# EAGLE design picB4currentreading (EAGLE 9.0.1)
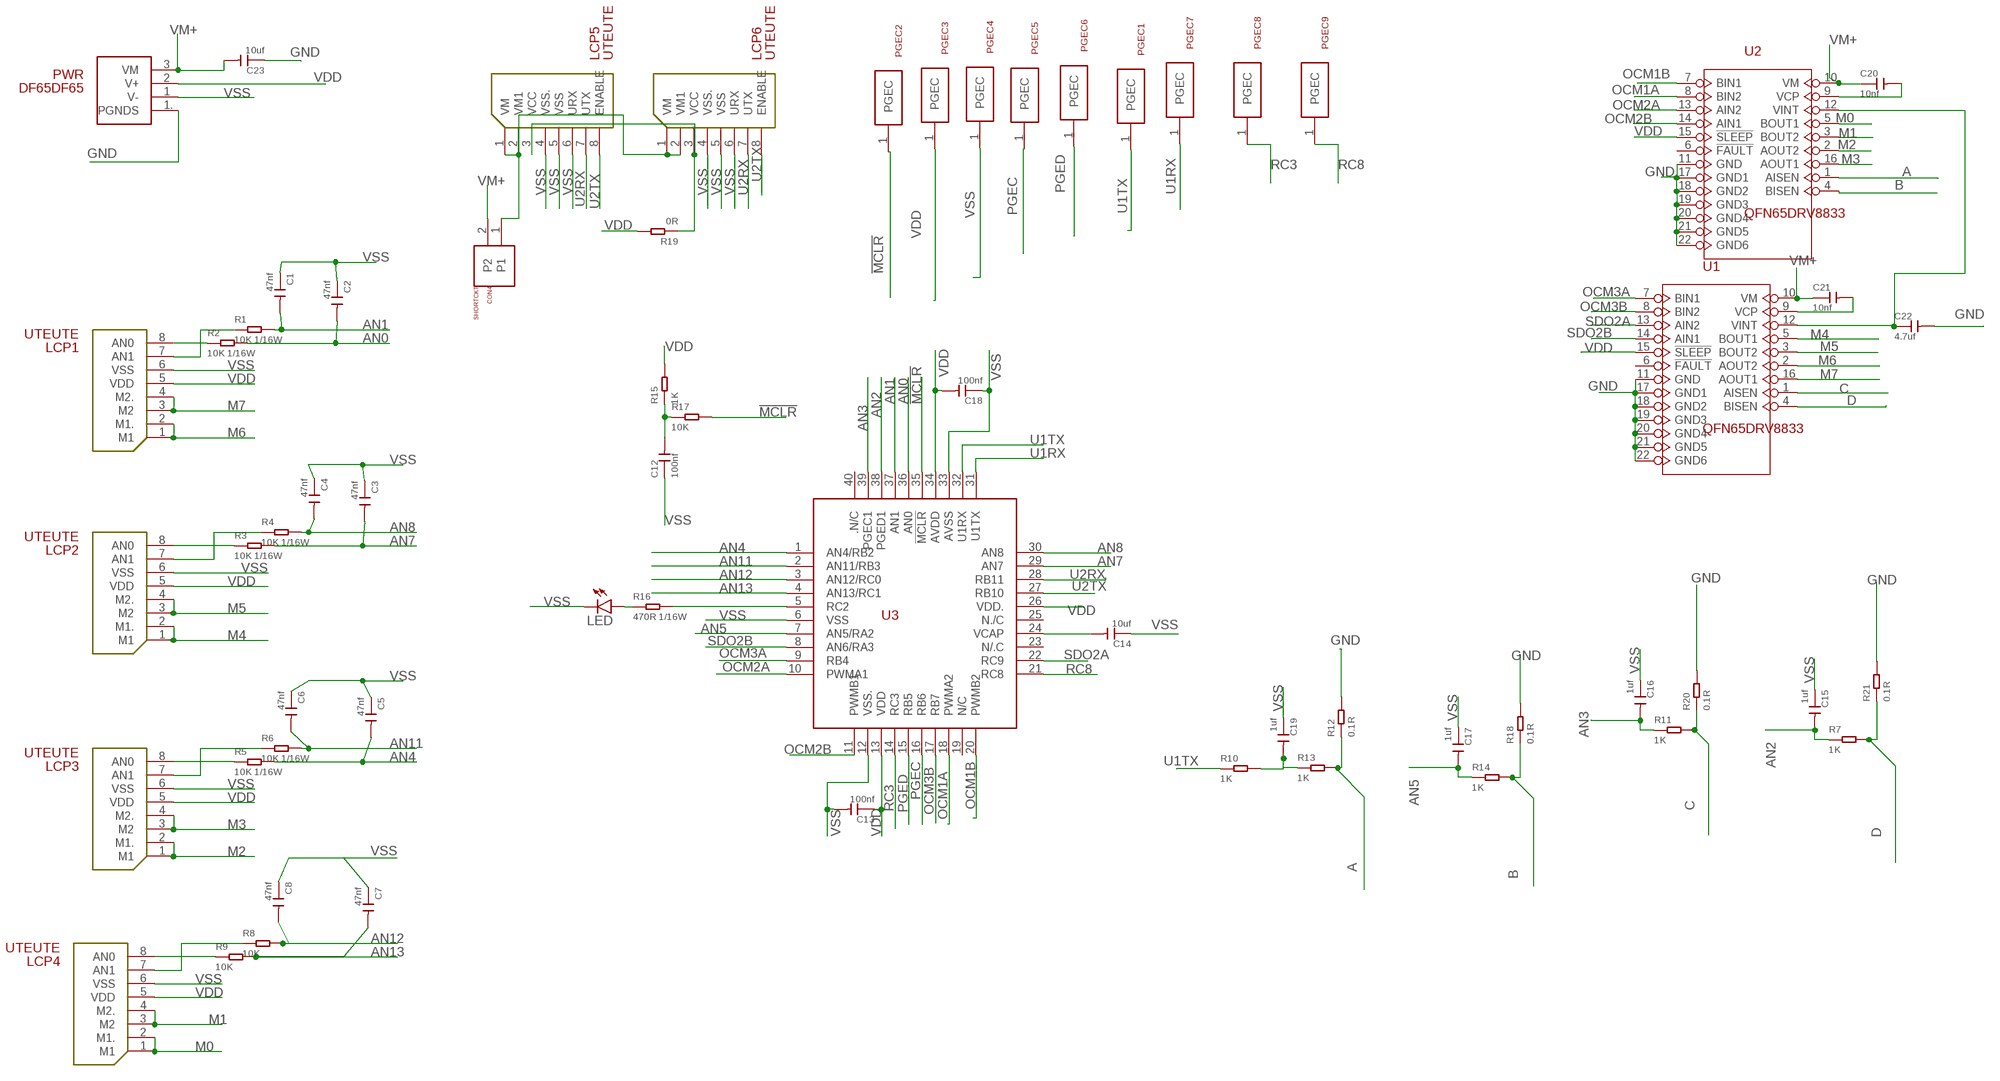
[diagram p0: schematic, sheet 1]

## Parts
C1  47nf  CERAMIC-47NF-25V-10%-X7R(0402)  [C0402]
C2  47nf  CERAMIC-47NF-25V-10%-X7R(0402)  [C0402]
C3  47nf  CERAMIC-47NF-25V-10%-X7R(0402)  [C0402]
C4  47nf  CERAMIC-47NF-25V-10%-X7R(0402)  [C0402]
C5  47nf  CERAMIC-47NF-25V-10%-X7R(0402)  [C0402]
C6  47nf  CERAMIC-47NF-25V-10%-X7R(0402)  [C0402]
C7  47nf  CERAMIC-47NF-25V-10%-X7R(0402)  [C0402]
C8  47nf  CERAMIC-47NF-25V-10%-X7R(0402)  [C0402]
C12  100nf  CERAMIC-100NF-25V-10%-X7R(0402)  [C0402]
C13  100nf  CERAMIC-100NF-25V-10%-X7R(0402)  [C0402]
C14  10uf  CERAMIC-10UF-6.3V-20%-X5R(0402)  [C0402]
C15  1uf  CERAMIC-1UF-10V-10%-X5R(0402)  [C0402]
C16  1uf  CERAMIC-1UF-10V-10%-X5R(0402)  [C0402]
C17  1uf  CERAMIC-1UF-10V-10%-X5R(0402)  [C0402]
C18  100nf  CERAMIC-100NF-25V-10%-X7R(0402)  [C0402]
C19  1uf  CERAMIC-1UF-10V-10%-X5R(0402)  [C0402]
C20  10nf  CERAMIC-10NF-50V-10%-X7R(0402)  [C0402]
C21  10nf  CERAMIC-10NF-50V-10%-X7R(0402)  [C0402]
C22  4.7uf  CERAMIC-4.7UF-6.3V-20%-X5R(0402)  [C0402]
C23  10uf  CERAMIC-10UF-6.3V-20%-X5R(0402)  [C0402]
CON4  SHORTCKT  [SHORT]
LCP1  UTEUTE  [UTE]
LCP2  UTEUTE  [UTE]
LCP3  UTEUTE  [UTE]
LCP4  UTEUTE  [UTE]
LCP5  UTEUTE  [UTE]
LCP6  UTEUTE  [UTE]
LED  LEDCHIP-LED0603  [CHIP-LED0603]
PGEC1  PGECPGEC  [PGEC]
PGEC2  PGECPGEC  [PGEC]
PGEC3  PGECPGEC  [PGEC]
PGEC4  PGECPGEC  [PGEC]
PGEC5  PGECPGEC  [PGEC]
PGEC6  PGECPGEC  [PGEC]
PGEC7  PGECPGEC  [PGEC]
PGEC8  PGECPGEC  [PGEC]
PGEC9  PGECPGEC  [PGEC]
PWR  DF65DF65  [DF65]
R1  10K 1/16W  SMD-RES-10K-1%-1/16W(0402)  [R0402]
R2  10K 1/16W  SMD-RES-10K-1%-1/16W(0402)  [R0402]
R3  10K 1/16W  SMD-RES-10K-1%-1/16W(0402)  [R0402]
R4  10K 1/16W  SMD-RES-10K-1%-1/16W(0402)  [R0402]
R5  10K 1/16W  SMD-RES-10K-1%-1/16W(0402)  [R0402]
R6  10K 1/16W  SMD-RES-10K-1%-1/16W(0402)  [R0402]
R7  1K  SMD-RES-1K-5%-1/16W(0402)  [R0402]
R8  10K  SMD-RES-10K-5%-1/(0402)  [R0402]
R9  10K  SMD-RES-10K-5%-1/(0402)  [R0402]
R10  1K  SMD-RES-1K-5%-1/16W(0402)  [R0402]
R11  1K  SMD-RES-1K-5%-1/16W(0402)  [R0402]
R12  0.1R  SMD-RES-0.1R-5%-1/8W(0805)  [R0805]
R13  1K  SMD-RES-1K-5%-1/16W(0402)  [R0402]
R14  1K  SMD-RES-1K-5%-1/16W(0402)  [R0402]
R15  1K  SMD-RES-1K-5%-1/16W(0402)  [R0402]
R16  470R 1/16W  SMD-RES-470R-5%-1/16W(0402)  [R0402]
R17  10K  SMD-RES-10K-5%-1/(0402)  [R0402]
R18  0.1R  SMD-RES-0.1R-5%-1/8W(0805)  [R0805]
R19  0R  SMD-RES-0R-5%-1/16W(0402)  [R0402]
R20  0.1R  SMD-RES-0.1R-5%-1/8W(0805)  [R0805]
R21  0.1R  SMD-RES-0.1R-5%-1/8W(0805)  [R0805]
U1  QFN65DRV8833  [QFN65P400X400X80-17N]
U2  QFN65DRV8833  [QFN65P400X400X80-17N]
U3  PIC32MM0064GPL036PIC32MM0064GPL36  [UQFN40MV5X5MM]

## Nets
!MCLR!: PGEC2.1(PGEC) R17.2 U3.35(!MCLR!)
A: R12.1 R13.2 U2.1(AISEN)
AN0: C2.2 R2.2 U3.36(AN0)
AN1: C1.2 R1.2 U3.37(AN1)
AN2: C15.2 R7.1 U3.38(PGED1)
AN3: C16.2 R11.1 U3.39(PGEC1)
AN4: C5.2 R5.2 U3.1(AN4/RB2)
AN5: C17.2 R14.1 U3.7(AN5/RA2)
AN7: C3.2 R3.2 U3.29(AN7)
AN8: C4.2 R4.2 U3.30(AN8)
AN11: C6.2 R6.2 U3.2(AN11/RB3)
AN12: C8.2 R8.2 U3.3(AN12/RC0)
AN13: C7.2 R9.2 U3.4(AN13/RC1)
B: R14.2 R18.1 U2.4(BISEN)
C: R11.2 R20.1 U1.1(AISEN)
D: R7.2 R21.1 U1.4(BISEN)
GND: C22.2 C23.1 PWR.1.(PGNDS) R12.2 R18.2 R20.2 R21.2 U1.11(GND) U1.17(GND1) U1.18(GND2) U1.19(GND3) U1.20(GND4) U1.21(GND5) U1.22(GND6) U2.11(GND) U2.17(GND1) U2.18(GND2) U2.19(GND3) U2.20(GND4) U2.21(GND5) U2.22(GND6)
M0 [motor line]: LCP4.1(M1) LCP4.2(M1.) U2.5(BOUT1)
M1 [motor line]: LCP4.3(M2) LCP4.4(M2.) U2.3(BOUT2)
M2 [motor line]: LCP3.1(M1) LCP3.2(M1.) U2.2(AOUT2)
M3 [motor line]: LCP3.3(M2) LCP3.4(M2.) U2.16(AOUT1)
M4 [motor line]: LCP2.1(M1) LCP2.2(M1.) U1.5(BOUT1)
M5 [motor line]: LCP2.3(M2) LCP2.4(M2.) U1.3(BOUT2)
M6 [motor line]: LCP1.1(M1) LCP1.2(M1.) U1.2(AOUT2)
M7 [motor line]: LCP1.3(M2) LCP1.4(M2.) U1.16(AOUT1)
N$2: LCP1.8(AN0) R2.1
N$3: C19.2 R10.2 R13.1
N$4: LCP3.7(AN1) R6.1
N$5: CON4.1 LCP5.1(VM) LCP5.2(VM1) LCP6.1(VM) LCP6.2(VM1)
N$6: LCP2.8(AN0) R3.1
N$7: LCP4.7(AN1) R8.1
N$8: LCP3.8(AN0) R5.1
N$9: LCP2.7(AN1) R4.1
N$10: LCP1.7(AN1) R1.1
N$11: C12.2 R15.1 R17.1
N$12: R16.2 U3.5(RC2)
N$13: LED.A R16.1
N$14: LCP5.3(VCC) LCP6.3(VCC) R19.1
N$17: LCP4.8(AN0) R9.1
N$20: C20.2 U2.9(VCP)
N$22: C21.2 U1.9(VCP)
N$23: C22.1 U1.12(VINT) U2.12(VINT)
N$41: C14.2 U3.24(VCAP)
OCM1A: U2.8(BIN2) U3.18(PWMA2)
OCM1B: U2.7(BIN1) U3.20(PWMB2)
OCM2A: U2.13(AIN2) U3.10(PWMA1)
OCM2B: U2.14(AIN1) U3.11(PWMB1)
OCM3A: U1.7(BIN1) U3.9(RB4)
OCM3B: U1.8(BIN2) U3.17(RB7)
PGEC: PGEC5.1(PGEC) U3.16(RB6)
PGED: PGEC6.1(PGEC) U3.15(RB5)
RC3: PGEC8.1(PGEC) U3.14(RC3)
RC8: PGEC9.1(PGEC) U3.21(RC8)
SDO2A: U1.13(AIN2) U3.22(RC9)
SDO2B: U1.14(AIN1) U3.8(AN6/RA3)
U1RX: PGEC7.1(PGEC) U3.31(U1TX)
U1TX: PGEC1.1(PGEC) R10.1 U3.32(U1RX)
U2RX: LCP5.7(UTX) LCP6.7(UTX) U3.28(RB11)
U2TX: LCP5.8(ENABLE) LCP6.8(ENABLE) U3.27(RB10)
VDD [power]: C13.1 C18.2 LCP1.5(VDD) LCP2.5(VDD) LCP3.5(VDD) LCP4.5(VDD) PGEC3.1(PGEC) PWR.2(V+) R15.2 R19.2 U1.15(!SLEEP!) U2.15(!SLEEP!) U3.13(VDD) U3.26(VDD.) U3.34(AVDD)
VM+ [motor line]: C20.1 C21.1 C23.2 CON4.2 PWR.3(VM) U1.10(VM) U2.10(VM)
VSS [power]: C1.1 C2.1 C3.1 C4.1 C5.1 C6.1 C7.1 C8.1 C12.1 C13.2 C14.1 C15.1 C16.1 C17.1 C18.1 C19.1 LCP1.6(VSS) LCP2.6(VSS) LCP3.6(VSS) LCP4.6(VSS) LCP5.4(VSS.) LCP5.5(VSS) LCP5.6(URX) LCP6.4(VSS.) LCP6.5(VSS) LCP6.6(URX) LED.C PGEC4.1(PGEC) PWR.1(V-) U3.6(VSS) U3.12(VSS.) U3.33(AVSS)
Unconnected: U1.6(!FAULT!) U2.6(!FAULT!) U3.19(N/C) U3.23(N/.C) U3.25(N./C) U3.40(.N/C)

## Library data of the parts
C1-C8 = Seeed-Capacitor:CERAMIC-47NF-25V-10%-X7R(0402): 302010002; MPN: CC0402KRX7R8BB473
C12 C13 C18 = Seeed-Capacitor:CERAMIC-100NF-25V-10%-X7R(0402): 302010024; MPN: CC0402KRX7R8BB104
C14 C23 = Seeed-Capacitor:CERAMIC-10UF-6.3V-20%-X5R(0402): 302010053; MPN: CC0402MRX5R5BB106
C15-C17 C19 = Seeed-Capacitor:CERAMIC-1UF-10V-10%-X5R(0402): 302010040; MPN: CC0402KRX5R6BB105
C20 C21 = Seeed-Capacitor:CERAMIC-10NF-50V-10%-X7R(0402): 302010006; MPN: CC0402KRX7R9BB103
C22 = Seeed-Capacitor:CERAMIC-4.7UF-6.3V-20%-X5R(0402): 302010019; MPN: CC0402MRX5R5BB475
CON4 = short:SHORT: <this is a point connectors and used for the short circuit the connections point if we needed >
LCP1-LCP4 = ute5526:UTE
LCP5 LCP6 = ute5526(uart):UTE
LED = led:LED: LED OSRAM: - CHIPLED LG R971, LG N971, LY N971, LG Q971, LY Q971, LO R971, LY R971 LH N974, LH R974 LS Q976, LO Q976, LY Q976 LO Q996 - Hyper CHIPLED LW Q18S LB Q993, LB Q99A, LB R99A - SideLED LS A670, LO A670, LY A670, LG A670, LP A670 LB A673, LV A673, LT A673, LW A673 LH A674 LY A675 LS A676, LA A676, LO A676, LY A676, LW A676 LS A679, LY A679, LG A679 - Hyper Micro SIDELED® LS Y876, LA Y876, LO Y876, LY Y876 LT Y87S - SmartLED LW L88C, LW L88S LB L89C, LB L89S, LG L890 LS L89K, LO L89K, LY L89K LS L896, LA L896, LO L896, LY L896 - TOPLED LS T670, LO T670, LY T670, LG T670, LP T670 LSG T670, LSP T670, LSY T670, LOP T670, LYG T670 LG T671, LOG T671, LSG T671 LB T673, LV T673, LT T673, LW T673 LH T674 LS T676, LA T676, LO T676, LY T676, LB T676, LH T676, LSB T676, LW T676 LB T67C, LV T67C, LT T67C, LS T67K, LO T67K, LY T67K, LW E67C LS E67B, LA E67B, LO E67B, LY E67B, LB E67C, LV E67C, LT E67C LW T67C LS T679, LY T679, LG T679 LS T770, LO T770, LY T770, LG T770, LP T770 LB T773, LV T773, LT T773, LW T773 LH T774 LS E675, LA E675, LY E675, LS T675 LS T776, LA T776, LO T776, LY T776, LB T776 LHGB T686 LT T68C, LB T68C - Hyper Mini TOPLED® LB M676 - Mini TOPLED Santana® LG M470 LS M47K, LO M47K, LY M47K Source: http://www.osram.convergy.de LUXEON: - LUMILED® LXK2-PW12-R00, LXK2-PW12-S00, LXK2-PW14-U00, LXK2-PW14-V00 LXK2-PM12-R00, LXK2-PM12-S00, LXK2-PM14-U00 LXK2-PE12-Q00, LXK2-PE12-R00, LXK2-PE12-S00, LXK2-PE14-T00, LXK2-PE14-U00 LXK2-PB12-K00, LXK2-PB12-L00, LXK2-PB12-M00, LXK2-PB14-N00, LXK2-PB14-P00, LXK2-PB14-Q00 LXK2-PR12-L00, LXK2-PR12-M00, LXK2-PR14-Q00, LXK2-PR14-R00 LXK2-PD12-Q00, LXK2-PD12-R00, LXK2-PD12-S00 LXK2-PH12-R00, LXK2-PH12-S00 LXK2-PL12-P00, LXK2-PL12-Q00, LXK2-PL12-R00 Source: www.luxeon.com KINGBRIGHT: KA-3528ASYC Source: www.kingbright.com
PGEC1-PGEC9 = pgec:PGEC: <this is a programming pin for the catchy point means PGEC port>
PWR = df65:DF65: <1.7mm pitch, Low Profile Wire-to-Board Connectors for Power Supplies DF65 series >
R1-R6 = Seeed-Resistor:SMD-RES-10K-1%-1/16W(0402): 301010047; MPN: RC0402FR-0710KL
R7 R10 R11 R13-R15 = Seeed-Resistor:SMD-RES-1K-5%-1/16W(0402): 301010006; MPN: RC0402JR-071KL
R8 R9 R17 = Seeed-Resistor:SMD-RES-10K-5%-1/(0402): 301010004; MPN: RC0402JR-0710KL
R12 R18 R20 R21 = Seeed-Resistor:SMD-RES-0.1R-5%-1/8W(0805): 301010264; MPN: RL0805JR-070R1L
R16 = Seeed-Resistor:SMD-RES-470R-5%-1/16W(0402): 301010013; MPN: RC0402JR-07470RL
R19 = Seeed-Resistor:SMD-RES-0R-5%-1/16W(0402): 301010000; MPN: RC0402JR-070RL
U1 U2 = QFN65P400X400X80-17N:QFN65
U3 = pic32xx40:PIC32MM0064GPL036

## Net classes
0 default: width 0.008 mm, clearance 0.152 mm
1 power: width 0 mm, drill 0 mm, clearance 0.152 mm
2 motor line: width 0 mm, clearance 0.152 mm

## Board
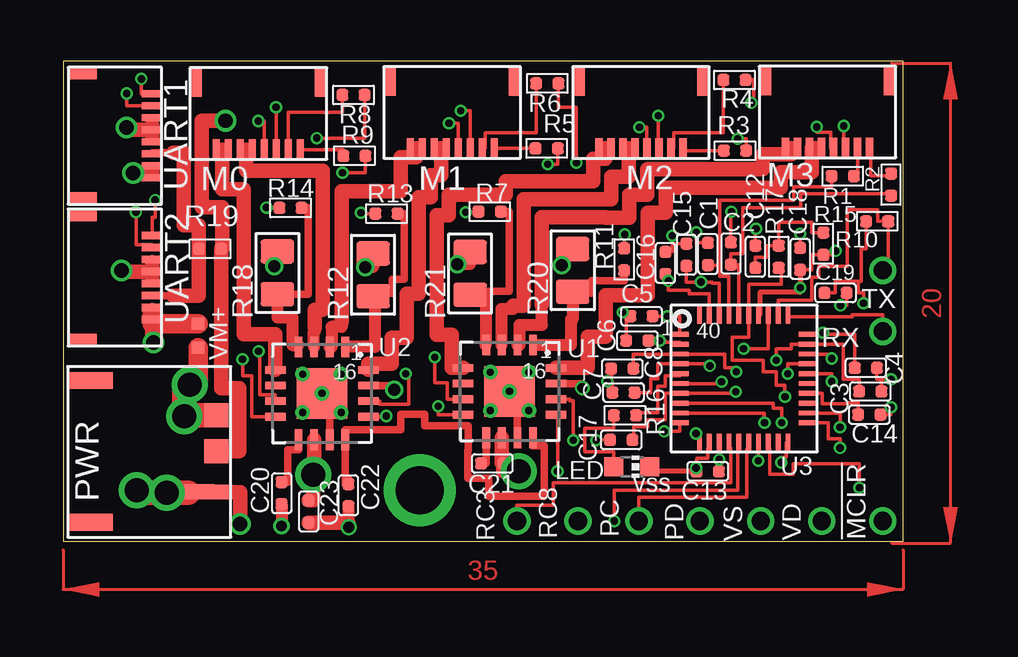
[diagram p1: board, top side]
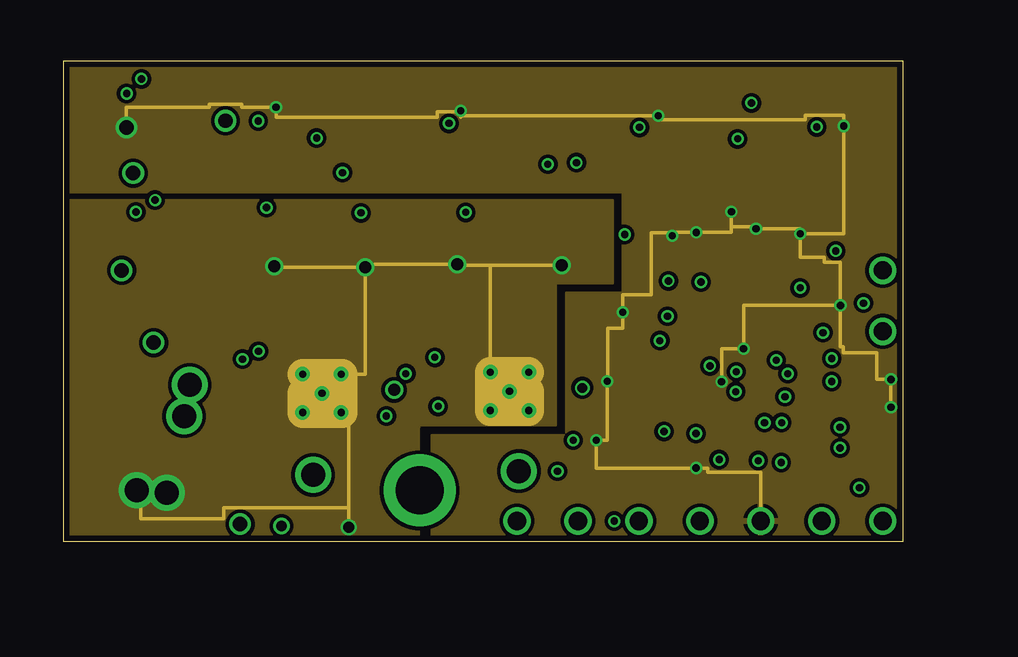
[diagram p2: board, inner layer Route2]
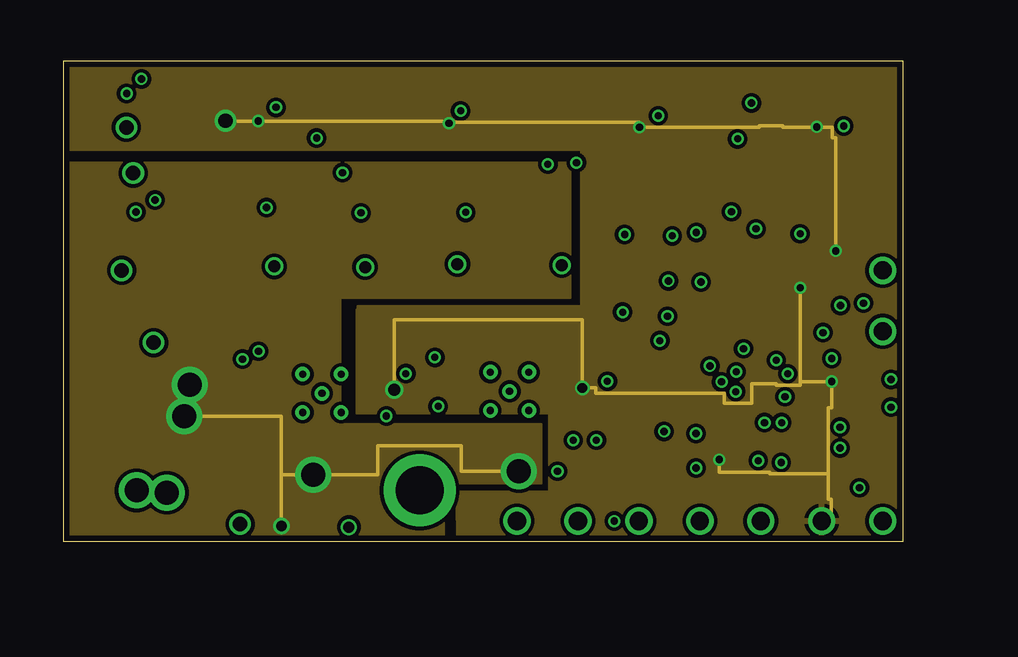
[diagram p3: board, inner layer Route15]
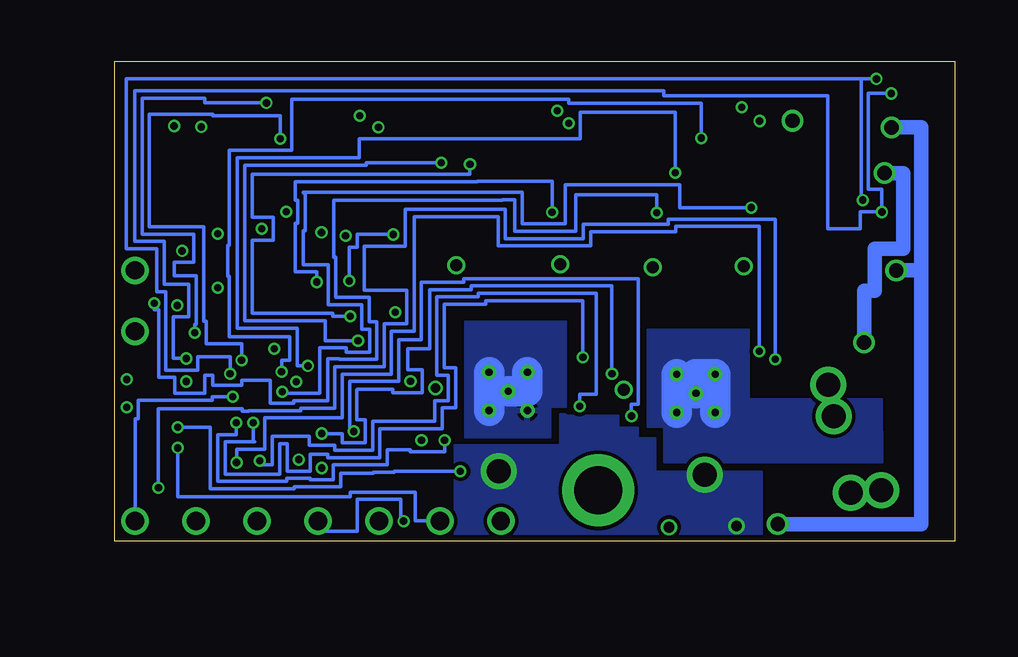
[diagram p4: board, bottom side, seen from below]

Size 35 x 20 mm. Coordinates in mm from the lower left corner, seen from the top.
Outline: 0,0 35,0 35,20 0,20 0,0
Copper layers (1*2*15*16): Top 0.035mm / dielectric 0.2mm / Route2 0.0175mm / dielectric 0.3mm / Route15 0.0175mm / dielectric 0.2mm / Bottom 0.035mm
Design rules "SeeedStudio_4layer_DRU_no_angle_20140221 *": minimum track width 6mil, minimum drill 6mil, track to track 4mil, track to pad 6mil, pad to pad 8mil, via to via 8mil, smd to smd 0mil, copper to edge 10mil, drill to drill 6mil, minimum pad ring 6mil, minimum via ring 4mil, stop-mask expansion 4mil, vias tented up to drill 250mil, thermal gap 6mil

### Footprints (pad centres in the part's own frame; a part is rotated, then mirrored left to right if it is on the bottom)
C0402 = smd 0.5 x 0.5: 1 0,0.463; 2 0,-0.463
SHORT = smd 0.5 x 0.5: 1 0.27,0.46; 2 0.27,-0.54
UTE = smd 0.85 x 0.3: 1 -3.5,1; 2 -3.5,0.5; 3 -3.5,0; 4 -3.5,-0.5; 5 -3.5,-1; 6 -3.5,-1.5; 7 -3.5,-2; 8 -3.5,-2.5 | smd 1.15 x 0.5: 9 -0.725,1.85; 10 -0.725,-3.35
UTE' = smd 0.85 x 0.3: 1 -3.5,1; 2 -3.5,0.5; 3 -3.5,0; 4 -3.5,-0.5; 5 -3.5,-1; 6 -3.5,-1.5; 7 -3.5,-2; 8 -3.5,-2.5 | smd 1.15 x 0.5: 9 -0.625,1.85; 10 -0.625,-3.35
CHIP-LED0603 = smd 0.8 x 0.8: A 0,-0.75; C 0,0.75
PGEC = drill 0.76: 1 0,0
DF65 = smd 1 x 0.6: 1 -2.58,1.73 | smd 1.27 x 0.635: 1. -1.882,1.72 | smd 1 x 1: 2 -2.58,0.03; 3 -2.58,-1.47 | smd 1.8 x 0.7: P$4 2.62,2.98; P$5 2.62,-2.92
R0402 = smd 0.5 x 0.5: 1 0,0.463; 2 0,-0.463
R0805 = smd 1.397 x 1.016: 1 0,0.889; 2 0,-0.889
QFN65P400X400X80-17N = smd 0.86 x 0.32: 1 -1.935,0.975; 2 -1.935,0.325; 3 -1.935,-0.325; 4 -1.935,-0.975; 9 1.935,-0.975; 10 1.935,-0.325; 11 1.935,0.325; 12 1.935,0.975 | smd 0.32 x 0.86: 5 -0.975,-1.935; 6 -0.325,-1.935; 7 0.325,-1.935; 8 0.975,-1.935; 13 0.975,1.935; 14 0.325,1.935; 15 -0.325,1.935; 16 -0.975,1.935 | smd 2.1 x 2.1: 17 0,0 | drill 0.3: 18 -0.8,0.8; 19 0.8,0.8; 20 -0.8,-0.8; 21 0.8,-0.8; 22 0,0
UQFN40MV5X5MM = smd 0.75 x 0.2: 1 -2.63,1.89; 2 -2.63,1.48; 3 -2.63,1.07; 4 -2.63,0.66; 5 -2.63,0.25; 6 -2.63,-0.16; 7 -2.63,-0.57; 8 -2.63,-0.98; 9 -2.63,-1.39; 10 -2.63,-1.8; 21 2.7,-1.8; 22 2.7,-1.39; 23 2.7,-0.98; 24 2.7,-0.57; 25 2.7,-0.16; 26 2.7,0.25; 27 2.7,0.66; 28 2.7,1.07; 29 2.7,1.48; 30 2.7,1.89 | smd 0.2 x 0.75: 11 -1.81,-2.62; 12 -1.4,-2.62; 13 -0.99,-2.62; 14 -0.58,-2.62; 15 -0.17,-2.62; 16 0.24,-2.62; 17 0.65,-2.62; 18 1.06,-2.62; 19 1.47,-2.62; 20 1.88,-2.62; 31 1.88,2.71; 32 1.47,2.71; 33 1.06,2.71; 34 0.65,2.71; 35 0.24,2.71; 36 -0.17,2.71; 37 -0.58,2.71; 38 -0.99,2.71; 39 -1.4,2.71; 40 -1.81,2.71

### Placement (x,y rotation side)
C1  26.86,11.97 0 top
C2  27.83,11.99 0 top
C3  33.63,6.24 270 top
C4  33.45,7.23 270 top
C5  24.1,9.38 90 top
C6  23.93,8.36 90 top
C7  23.35,6.2 90 top
C8  23.3,7.2 90 top
C12  28.84,11.86 0 top
C13  26.86,2.92 270 top
C14  33.59,5.28 270 top
C15  25.97,11.94 0 top
C16  25.09,11.6 0 top
C17  23.26,4.23 90 top
C18  30.71,11.77 0 top
C19  32.18,10.35 270 top
C20  9.11,2.01 180 top
C21  17.88,3.24 270 top
C22  11.89,1.92 0 top
C23  10.23,1.25 180 top
CON4  5.35,8.61 0 top
LCP1  31.1,19.89 90 top
LCP2  23.33,19.87 90 top
LCP3  15.46,19.87 90 top
LCP4  7.38,19.82 90 top
LCP5  UTEUTE  [UTE']  0.21,16.14 180 top
LCP6  UTEUTE  [UTE']  0.21,10.24 180 top
LED  23.7,3.11 270 top
PGEC1  34.15,11.29 0 top
PGEC2  34.15,0.85 0 top
PGEC3  31.61,0.85 0 top
PGEC4  29.07,0.85 0 top
PGEC5  23.99,0.85 0 top
PGEC6  26.53,0.85 0 top
PGEC7  34.15,8.75 0 top
PGEC8  18.91,0.85 0 top
PGEC9  21.45,0.85 0 top
PWR  3.79,3.78 180 top
R1  32.48,15.22 270 top
R2  34.5,14.86 0 top
R3  27.99,16.27 90 top
R4  27.98,19.22 90 top
R5  20.15,16.37 90 top
R6  20.17,19.08 90 top
R7  17.78,13.74 90 top
R8  12.1,18.6 90 top
R9  12.14,16.07 90 top
R10  33.92,13.34 270 top
R11  23.38,11.75 0 top
R12  12.91,11.1 180 top
R13  13.47,13.66 90 top
R14  9.47,13.89 90 top
R15  31.68,12.4 0 top
R16  23.41,5.25 90 top
R17  29.82,11.85 0 top
R18  8.93,11.19 180 top
R19  6.12,12.19 90 top
R20  21.23,11.29 180 top
R21  16.96,11.16 180 top
U1  18.6,6.25 270 top
U2  10.78,6.17 270 top
U3  28.32,6.74 0 top

### Tracks (layer width: path | path; a pad name or v marks a point on that pad's centre or on a via)
!MCLR!  (via drill 0.3)
  Top 0.152: R17.2 29.93,11.39 29.93,10.71 28.56,10.71 U3.35 28.56,8.5 27.87,8.5 27.87,7.54 29.18,7.54 29.18,7.06 29.71,7.06 29.71,6.5 30.08,6.5 v30.08,6.02
  Bottom 0.152: PGEC2.1 34.15,5.11 34.01,5.11 34.01,5.87 30.94,5.87 30.94,6.02 v30.08,6.02
A
  Top 0.152: U2.1 11.85,8.1
  Top 0.305: R12.1 12.91,10.33 13.71,10.33 13.71,10.92 14.21,10.92 14.21,13.66 R13.2
  Top 0.508: 11.85,8.1 12.99,8.1 12.99,10.21 R12.1
AN0
  Top 0.152: U3.36 28.15,11.53 C2.2 27.83,11.98 28.33,11.98 28.33,13.91 30.75,13.91 30.75,14.47 34.5,14.47 R2.2
AN1
  Top 0.152: C1.2 27.35,11.51 | 27.35,11.51 27.35,12.93 27.37,12.93 27.37,14.21 30.44,14.21 30.44,14.78 32.02,14.78 R1.2 | U3.37 27.74,11.05 27.35,11.05 27.35,11.51
AN2  (via drill 0.3)
  Top 0.152: R7.1 16.78,13.74 v16.78,13.71 | C15.2 25.97,10.8 v26.58,10.8 27.05,10.8 27.05,10.75 27.33,10.75 U3.38
  Bottom 0.152: v16.78,13.71 16.78,15.01 19.89,15.01 19.89,14.99 27.48,14.99 27.48,14.21 27.37,14.21 27.37,13.25 27.48,13.25 27.48,11.23 26.58,11.23 v26.58,10.8
AN3  (via drill 0.3)
  Top 0.152: R11.1 23.38,12.79 v23.4,12.79 | U3.39 26.92,10.32 26.1,10.32 26.1,10.45 25.22,10.45 v25.22,10.85 25.09,10.85 C16.2
  Bottom 0.152: v25.22,10.85 25.22,12.25 24.9,12.25 24.9,12.79 v23.4,12.79
AN4  (via drill 0.3)
  Top 0.152: U3.1 25.69,9.38 v25.18,9.38 C5.2 | R5.2 20.61,15.71 v20.2,15.71
  Bottom 0.152: v20.2,15.71 20.2,15.29 29.27,15.29 29.27,13.5 28.39,13.5 28.39,12.54 29.27,12.54 29.27,9.5 25.91,9.5 25.91,9.38 v25.18,9.38
AN5  (via drill 0.3)
  Top 0.152: R14.1 8.47,13.89 v8.47,13.91 | v28.02,6.24 28.02,6.17 27.34,6.17 U3.7 25.09,6.17 25.09,5.06 24.93,5.06 24.36,5.06 24.36,4.77 23.78,4.77 23.78,4.23 C17.2
  Bottom 0.152: v8.47,13.91 11.46,13.91 11.46,14.85 16.22,14.85 16.22,13.23 18.02,13.23 18.02,14.54 27.14,14.54 27.14,14.52 27.06,14.52 27.06,12.95 27.14,12.95 27.14,11.53 26.1,11.53 26.1,9.86 24.7,9.86 24.7,8.84 24.38,8.84 24.38,7.88 24.54,7.88 25.34,7.88 25.34,8.06 26.45,8.06 26.45,6.17 27.91,6.17 27.91,6.24 v28.02,6.24
AN7  (via drill 0.3)
  Top 0.152: C3.2 33.17,6.75 32.51,6.75 32.51,8.21 U3.29 30.34,8.21 30.34,8.02 29.71,8.02 v29.71,7.54 | R3.2 28.46,16.77 v28.11,16.77
  Bottom 0.152: v28.11,16.77 28.11,17.74 30.92,17.74 30.92,17.79 33.56,17.79 33.56,13.11 31.3,13.11 31.3,9.18 31.18,9.18 31.18,8.22 29.71,8.22 v29.71,7.54
AN8  (via drill 0.3)
  Top 0.152: C4.2 32.98,8.62 31.66,8.62 | R4.2 28.77,19.22 28.77,18.27 v28.68,18.27 | U3.30 31.66,8.62 | 31.66,8.62 v31.66,8.7
  Bottom 0.152: v28.68,18.27 31.26,18.27 31.26,18.47 33.86,18.47 33.86,12.8 31.71,12.8 31.71,11.62 32.52,11.62 32.52,11.07 31.61,11.07 31.61,9.04 31.66,9.04 v31.66,8.7
AN11  (via drill 0.3)
  Top 0.152: U3.2 25.69,8.3 25.09,8.3 25.09,8.36 v24.86,8.36 C6.2 | v21.39,15.78 21.39,18.09 20.63,18.09 R6.2
  Bottom 0.152: v21.39,15.78 24.51,15.78 24.51,15.68 29.57,15.68 29.57,9.19 26.22,9.19 26.22,8.36 v24.86,8.36
AN12  (via drill 0.3)
  Top 0.152: R8.2 12.56,16.8 v10.56,16.8 | C8.2 23.76,7.8 U3.3 27.57,7.8 27.57,7.24 28.05,7.24 v28.05,7.06
  Bottom 0.152: v10.56,16.8 10.56,18.26 16.08,18.26 16.08,18.42 27.63,18.42 27.63,16.29 30.23,16.29 30.23,12.34 30.29,12.34 30.29,11.04 30.23,11.04 30.23,8.53 27.7,8.53 27.7,7.54 28.05,7.54 v28.05,7.06
AN13  (via drill 0.3)
  Top 0.152: C7.2 24.48,6.2 24.48,6.78 24.77,6.78 24.77,7.39 U3.4 26.95,7.39 v26.95,7.31 | R9.2 12.6,15.36 v11.64,15.36
  Bottom 0.152: v11.64,15.36 11.64,17.89 15.6,17.89 15.6,16.77 24.82,16.77 24.82,15.98 29.89,15.98 29.89,8.89 27.4,8.89 27.4,7.31 v26.95,7.31
B
  Top 0.15: U2.4 9.81,8.17 9.55,8.17
  Top 0.152: U2.4 9.81,8.21
  Top 0.305: R18.1 10.22,10.3 10.22,13.89 R14.2
  Top 0.508: R18.1 8.93,9.33 9.55,9.33 9.55,8.17 9.79,8.17
C
  Top 0.152: U1.1 19.67,8.18
  Top 0.305: R20.1 22,10.4 22,10.35 22,10.86 23.38,10.86 R11.2
  Top 0.508: R20.1 21.23,9.24 21.16,9.24 21.16,8.18 19.67,8.18
D
  Top 0.152: 17.61,8.18 U1.4
  Top 0.305: R21.1 16.96,10.42 18.59,10.42 18.59,13.74 R7.2
  Top 0.508: R21.1 17.61,10.27 17.61,8.18
GND  (via drill 0.45, 0.5, 1)
  Top 0.152: PWR.1. 5.67,2.03 5.21,2.03 | 10.78,5.37 10.78,5.48 U2.22 11.58,6.17 | 11.58,6.17 U2.19 10.78,5.37 | U1.20 19.36,7.05 | 19.36,7.05 U1.18 | 11.58,6.17 U2.18 | 10.78,5.37 U2.21 | 19.36,6.25 19.36,7.05 | 18.6,5.53 17.89,5.53 U1.21 18.6,5.45 | 19.4,6.25 U1.19 | 18.93,6.25 18.93,5.45 18.6,5.45 | 18.6,5.53 18.6,5.45 | U1.22 18.6,5.53
  Top 0.305: 18.93,5.45 U1.11 | U2.11 11.11,5.48 10.78,5.48
  Top 0.508: C22.2 11.89,0.59 v11.91,0.59 | R18.2 8.93,11.46 v8.8,11.46 | R12.2 12.91,11.43 v12.58,11.43 | R21.2 16.96,11.55 v16.43,11.55 | R20.2 20.78,12.18 v20.78,11.51
  Top 0.6: C23.1 11.89,0.78 11.89,0.59
  Top 1.016: v3.06,2.12 3.06,2.03 v4.32,2.03 5.21,2.03
  Route2 0.15: v20.78,11.51 17.82,11.51 17.8,11.51 | 17.8,11.51 16.43,11.51 v16.43,11.55 12.58,11.55 v12.58,11.43 | v12.58,11.43 8.8,11.43 v8.8,11.46 | v12.58,11.43 12.58,6.97 11.64,6.97 | U1.20 17.8,11.51
  Route2 0.152: v3.06,2.12 3.23,2.12 3.23,0.94 6.69,0.94 6.69,1.39 11.91,1.39 | v11.91,0.59 11.91,1.39 | 11.91,1.39 11.91,5.37 11.64,5.37 11.62,5.37 | 10.88,6.97 U2.20
  Route2 0.7: U2.19 11.62,5.37
  Route2 1.27: U2.20 U2.18 | U2.18 10.78,6.97 U2.22 9.98,6.17 U2.21 U2.19 | U2.18 11.64,6.97 11.64,5.37 | U1.20 U1.18 18.6,7.05 U1.22 19.4,6.25 U1.19 U1.21 U1.20
  Bottom 1.27: U2.18 U2.19 | U2.21 U2.20 10.78,6.97 U2.22 | U1.19 U1.18 | U1.20 17.8,6.25 U1.22
  pour Route2: 14.83,4.75 14.84,4.75 14.84,4.83 20,4.83 20.52,4.83 20.52,10.75 22.9,10.75 22.9,14.21 -0.39,14.21 -0.39,12.62 -0.39,-0.49 14.82,-0.49
  pour Bottom: 3.02,3.29 12.1,3.29 12.1,4.78 12.8,4.78 12.8,8.75 12.8,8.82 8.58,8.82 8.58,5.92 8.49,5.92 3.03,5.92
  pour Bottom: 16.21,5.6 16.86,5.6 16.86,4.33 20.4,4.33 20.4,9.15 16.22,9.15
M0
  Top 0.152: LCP4.1 6.62,16.32 LCP4.2
  Top 0.6: 6.62,16.32 6.62,14.66 7.53,14.66 7.53,11.17 7.53,8.62 8.85,8.62 U2.5
M1
  Top 0.152: LCP4.3 7.64,16.32 LCP4.4 | U2.3
  Top 0.508: 10.49,8.92 10.49,8.76 10.45,8.76 U2.3
  Top 0.6: 7.64,16.32 7.64,15.45 10.82,15.45 10.82,9.64 10.49,9.64 10.49,8.92
M2
  Top 0.152: LCP3.1 14.71,16.37 LCP3.2
  Top 0.508: 11.61,9.16 11.61,8.94 11.19,8.94 11.19,8.1 U2.2
  Top 0.6: 14.71,16.37 14.71,16.01 14.07,16.01 14.07,14.59 11.61,14.59 11.61,9.16
M3
  Top 0.152: LCP3.3 15.73,16.37 LCP3.4
  Top 0.6: 15.73,16.37 15.74,16.37 15.74,15.26 15.32,15.26 15.32,14.33 14.82,14.33 14.82,10.31 14.32,10.31 14.32,8.48 13.69,8.48 13.69,7.4 12.72,7.4 U2.16
M4
  Top 0.152: LCP2.1 22.58,16.37 LCP2.2
  Top 0.6: 22.58,16.37 22.58,15.94 22.09,15.94 22.09,15.01 18.45,15.01 18.45,14.44 16.07,14.44 16.07,13.58 15.57,13.58 15.57,8.61 16.2,8.61 16.2,7.22 U1.5
M5
  Top 0.152: LCP2.3 23.57,16.37 LCP2.4 | U1.3 18.27,8.18
  Top 0.508: 18.75,9.82 18.75,9.68 18.27,9.68 18.27,8.18
  Top 0.6: 23.57,16.37 23.57,15.19 22.84,15.19 22.84,14.26 19.2,14.26 19.2,9.82 18.75,9.82
M6
  Top 0.152: LCP1.1 30.35,16.39 LCP1.2
  Top 0.508: U1.2 19.01,8.18 19.01,9.02 19.95,9.02 19.95,9.86
  Top 0.6: 19.95,9.86 19.95,13.5 22.61,13.5 22.61,13.49 23.6,13.49 23.6,14.44 24.35,14.44 24.35,15.49 29.16,15.49 29.16,16.14 30.35,16.14 30.35,16.39
M7
  Top 0.152: LCP1.3 31.34,16.39 | 31.46,16.39 LCP1.4
  Top 0.6: U1.16 21.86,7.22 21.86,8.53 22.61,8.53 22.61,10.25 24.35,10.25 24.35,13.69 25.1,13.69 25.1,14.74 29.91,14.74 29.91,15.38 31.2,15.38 31.2,16.39 31.34,16.39 31.46,16.39
N$1  (via drill 2)
  other vias: 14.86,2.12
N$2
  Top 0.152: LCP1.8 33.64,16.39 33.64,15.22 34.5,15.22 R2.1
N$3  (via drill 0.3)
  Top 0.152: R10.2 33.46,12.19 33.25,12.19 33.25,10.83 33.12,10.83 | R13.1 12.41,13.66 v12.41,13.69 | v33.35,9.93 33.35,10.35 33.12,10.35 33.12,10.83 | C19.2 32.17,10.35 32.17,10.83 33.12,10.83
  Bottom 0.152: v33.35,9.93 33.35,9.65 33.17,9.65 33.17,6.83 32.51,6.83 32.51,6.18 31.24,6.18 31.24,6.91 30.91,6.91 30.91,6.5 29.71,6.5 29.71,6.72 28.53,6.72 28.53,5.75 27.54,5.75 27.54,5.86 26.13,5.86 26.13,7.61 25.65,7.61 25.65,7.58 24.08,7.58 24.08,9.15 24.4,9.15 24.4,10.16 25.79,10.16 25.79,11.84 25.88,11.84 25.88,14.21 18.85,14.21 18.85,14.23 18.33,14.23 18.33,12.92 15.78,12.92 15.78,14.44 12.41,14.44 v12.41,13.69
N$4
  Top 0.152: LCP3.7 17.58,16.37 17.58,17.02 19.71,17.02 R6.1
N$5  (via drill 0.6)
  Top 0.2: LCP6.2 3.71,9.53 LCP6.1 | LCP5.1 3.71,15.43 LCP5.2
  Top 0.6: 3.71,9.53 3.71,8.28 v3.77,8.28 | 3.71,15.43 3.71,15.34 v2.92,15.34
  Top 0.813: CON4.1 3.71,9.07 3.71,9.53
  Bottom 0.6: v2.92,15.34 2.15,15.34 2.15,12.19 3.34,12.19 3.34,10.45 3.77,10.45 v3.77,8.28
N$6
  Top 0.152: LCP2.8 25.83,16.27 R3.1
N$7
  Top 0.152: LCP4.7 9.38,17.88 11.63,17.88 R8.1
N$8
  Top 0.152: LCP3.8 R5.1
N$9
  Top 0.152: LCP2.7 25.45,16.37 25.45,17.02 27.51,17.02 R4.1
N$10
  Top 0.152: R1.1 33.1,15.22 LCP1.7
N$11
  Top 0.152: C12.2 28.84,11.84 29.32,11.84 29.32,12.32 R17.1 29.82,13.3 31.19,13.3 31.19,12.86 R15.1
N$12
  Top 0.152: R16.2 23.88,5.37 24.79,5.37 24.79,6.47 25.09,6.47 25.09,6.9 25.69,6.9 U3.5
N$13
  Top 0.152: LED.A 22.95,3.73 21.74,3.73 21.74,4.71 22.95,4.71 R16.1
N$14
  Top 0.305: 4.58,10.23 4.58,10.24 LCP6.3 | 4.58,16.19 3.71,16.19 LCP5.3
  Top 0.6: 4.58,10.23 5.66,10.23 R19.1 5.66,13.16 5.03,13.16 5.03,16.19 4.58,16.19
N$17
  Top 0.152: R9.1 11.67,16.32 LCP4.8
N$20
  Top 0.305: C20.2 9.36,2.47 9.36,3.82 9.81,3.82 U2.9
N$22
  Top 0.305: C21.2 17.63,3.24 U1.9
N$23
  Top 0.305: 11.89,2.62 C22.1 11.76,2.38 U2.12 11.76,4.66 14.07,4.66 14.07,5.29 15.07,5.29 15.07,4.81 16.88,4.81 16.88,3.8 16.87,3.8 16.87,2.64 17.74,2.64 17.74,1.88 20.04,1.88 20.04,3.98 19.58,3.98 U1.12
N$41
  Top 0.152: C14.2 33.13,5.76 32.69,5.76 32.69,5.73 31.63,5.73 31.63,6.17 U3.24
OCM1A  (via drill 0.3)
  Top 0.152: U2.8 7.86,5.19 7.86,6.9 7.47,6.9 v7.47,7.59 | U3.18 29.38,3.84 29.44,3.84 29.44,2.81 30.43,2.81 30.43,3.24 33.17,3.24 v33.17,2.23 v33.18,2.23
  Bottom 0.152: v7.47,7.59 7.47,13.42 11.93,13.42 11.93,13.21 12.89,13.21 12.89,13.22 15.48,13.22 15.48,12.62 18.72,12.62 18.72,13.84 22.89,13.84 22.89,12.29 24.59,12.29 24.59,10.47 22.83,10.47 22.83,9.06 23.77,9.06 23.77,7.27 25.82,7.27 25.82,5.55 27.24,5.55 27.24,5.45 29.42,5.45 29.42,5.42 29.69,5.42 29.69,5.51 33.18,5.51 v33.18,2.23
OCM1B  (via drill 0.3)
  Top 0.152: U2.7 8.85,6.1 8.19,6.1 8.19,7.92 v8.14,7.92 | v29.92,3.29 29.92,3.51 30.12,3.51 30.12,4.12 U3.20
  Bottom 0.152: v8.14,7.92 8.14,13.12 11.63,13.12 11.63,12.9 13.2,12.9 15.17,12.9 15.17,12.31 19.03,12.31 19.03,13.53 22.53,13.53 22.53,8.75 23.47,8.75 23.47,6.97 25.52,6.97 25.52,5.14 28.74,5.14 28.74,3.84 29.92,3.84 v29.92,3.29
OCM2A  (via drill 0.3)
  Top 0.152: U2.13 13.47,5.19 v13.47,5.22 | v25.04,4.58 25.69,4.58 U3.10
  Bottom 0.152: v13.47,5.22 13.47,5.7 13.19,5.7 13.19,10.95 20.46,10.95 20.46,10.79 22.22,10.79 22.22,8.41 23.16,8.41 23.16,6.66 25.22,6.66 25.22,4.58 v25.04,4.58
OCM2B  (via drill 0.3)
  Top 0.152: U2.14 13.19,5.84 13.19,5.7 14.39,5.7 14.39,6.91 14.28,6.91 v14.28,6.99 | U3.11 26.51,4.49 v26.37,4.49
  Bottom 0.15: 25.52,4.49 25.52,4.1 24.56,4.1 24.56,5.06 24.69,5.06
  Bottom 0.152: v14.28,6.99 14.28,10.64 20.15,10.64 20.15,10.49 21.88,10.49 21.88,8.02 22.8,8.02 22.8,7.15 22.2,7.15 22.2,6.19 23.41,6.19 23.41,6.33 24.89,6.33 24.89,6.32 24.91,6.32 24.91,5.06 24.69,5.06 24.56,5.06 | v26.37,4.49 25.52,4.49
OCM3A  (via drill 0.3)
  Top 0.152: U1.7 16.01,5.92 16.01,6.6 15.49,6.6 v15.49,7.67 | U3.9 29.22,5.34 v29.22,4.95
  Bottom 0.152: v29.22,4.95 29.22,4.16 29.18,4.16 29.18,4.15 30.4,4.15 30.4,2.81 28.13,2.81 28.13,3.95 28.13,4.07 27.81,4.07 27.81,2.93 26.85,2.93 26.85,3.62 26.13,3.62 26.13,3.49 23.95,3.49 23.95,4.69 21.36,4.69 21.36,5.56 20.8,5.56 20.8,7.23 21.27,7.23 21.27,9.88 19.54,9.88 19.54,10.03 15.49,10.03 v15.49,7.67
OCM3B  (via drill 0.3)
  Top 0.152: U1.8 15.63,5.27 v15.63,5.63 | v28.96,3.36 28.97,3.36 U3.17
  Bottom 0.15: 25.82,3.79 25.82,4.01 26.89,4.01
  Bottom 0.152: v15.63,5.63 15.63,6.13 14.93,6.13 14.93,10.34 19.85,10.34 19.85,10.19 21.58,10.19 21.58,6.93 21.1,6.93 21.1,5.87 21.66,5.87 21.66,5 24.25,5 24.25,3.79 25.82,3.79 | 26.89,4.01 26.89,4.37 28.44,4.37 28.44,4.08 28.44,3.18 28.96,3.18 v28.96,3.36
PGEC
  Top 0.152: U3.16 28.56,3.84 28.48,3.84 28.48,1.83 23.99,1.83 PGEC5.1
PGED  (via drill 0.3)
  Top 0.152: U3.15 28.12,4.12 28.12,2.14 22.95,2.14 22.95,0.71 22.96,0.71 v22.96,0.84
  Bottom 0.152: v22.96,0.84 23.09,0.84 23.09,1.75 24.89,1.75 24.89,0.43 26.53,0.43 PGEC6.1
RC3
  Top 0.15: PGEC8.1 18.91,1.5 20.42,1.5 20.42,2.44 27.81,2.44 27.81,3.89 27.74,3.89 U3.14
RC8  (via drill 0.3)
  Top 0.152: v32.37,3.89 32.37,4.28 31.89,4.28 31.89,4.93 U3.21
  Bottom 0.152: PGEC9.1 22.48,0.85 22.48,2.06 25.2,2.06 25.2,1.85 32.37,1.85 v32.37,3.89
SDO2A  (via drill 0.3)
  Top 0.15: U1.13 20.6,5.27 v20.6,2.92 | v32.37,4.76 32.37,5.34 U3.22
  Bottom 0.152: v20.6,2.92 23.34,2.92 23.34,2.88 24.22,2.88 24.22,2.83 25.59,2.83 25.59,2.27 27.53,2.27 27.53,2.2 31.01,2.2 31.01,4.76 v32.37,4.76
SDO2B  (via drill 0.3)
  Top 0.15: U3.8 29.6,5.75 29.6,5.54 29.94,5.54 v29.94,4.95 | v21.26,4.21 21.26,5.87 21.1,5.87 21.1,5.92 U1.14
  Bottom 0.15: v29.94,4.95 29.94,4.45 30.71,4.45 30.71,2.5 27.83,2.5 27.83,2.62 26.85,2.62 26.85,2.58 25.89,2.58 25.89,3.19 23.65,3.19 23.65,3.82 22.7,3.82 22.7,3.73 21.26,3.73 v21.26,4.21
U1RX
  Top 0.152: PGEC7.1 34.15,9.45 32.87,9.45 32.87,9.35 30.2,9.35 U3.31
U1TX
  Top 0.152: U3.32 29.79,10.05 31.19,10.05 31.19,11 31.49,11 31.49,11.46 32.67,11.46 32.67,13.81 33.93,13.81 33.93,13.34 R10.1 34.38,11.29 PGEC1.1
U2RX  (via drill 0.3)
  Top 0.152: LCP5.7 2.65,18.14 v2.65,18.66 | U3.28 32.02,7.8 32.02,7.67 32.03,7.67 v32.03,7.62 | LCP6.7 3.71,12.36 3.05,12.36 3.05,13.72 v3.03,13.72
  Bottom 0.152: v2.65,18.66 3.6,18.66 3.6,14.66 3.03,14.66 v3.03,13.72 3.94,13.72 3.94,13.02 5.29,13.02 5.29,18.56 12.12,18.56 12.12,18.77 34.17,18.77 34.17,12.49 32.95,12.49 32.95,10.71 31.91,10.71 31.91,9.35 32.56,9.35 32.56,7.62 v32.03,7.62
U2TX  (via drill 0.3)
  Top 0.152: LCP5.8 3.26,18.64 v3.26,19.27 | U3.27 30.19,7.39 v30.19,6.98 | LCP6.8 3.71,13.5 3.83,13.5 v3.83,14.22
  Bottom 0.152: v3.83,14.22 3.83,14.36 3.9,14.36 3.9,19.27 v3.26,19.27 34.52,19.27 34.52,12.19 33.25,12.19 33.25,10.4 32.87,10.4 32.87,7.14 31.55,7.14 31.55,7.69 30.19,7.69 v30.19,6.98
VDD  (via drill 0.3, 0.4, 0.5, 0.6)
  Top 0.152: LCP4.5 8.38,17.51 v8.13,17.51 | v16.08,17.41 16.46,17.41 LCP3.5 | LCP2.5 24.33,17.25 v24.01,17.25 | v31.4,17.27 31.4,17.04 31.99,17.04 31.99,16.39 LCP1.5 | C18.2 31.19,11.31 31.19,11.93 R15.2 32.2,11.93 v32.2,12.1 | U3.26 32.03,6.99 v32.03,6.66 | v13.79,6.31 13.79,6.49
  Top 0.2: C13.1 v27.33,3.41 U3.13 | C18.2 v30.71,10.56 30.71,10.38 29.03,10.38 29.03,9.45 U3.34
  Top 0.305: U2.15 13.79,6.49 | v21.63,6.4 21.63,6.57 U1.15
  Top 0.6: PWR.2 7.33,3.75 7.33,6.37 6.58,6.37 R19.2 6.63,12.19 6.63,13.91 5.78,13.91 5.78,17.52 v6.77,17.52
  Route15 0.15: v27.33,3.41 27.33,2.88 29.44,2.88 29.44,2.81 31.89,2.81 31.89,2.9
  Route15 0.152: 16.08,17.46 16.08,17.51 v8.13,17.51 v6.77,17.51 v6.77,17.52 | 16.08,17.46 v16.08,17.41 | 31.4,17.25 v31.4,17.27 | 16.08,17.46 24.01,17.46 v24.01,17.25 29.02,17.25 29.02,17.32 29.98,17.32 29.98,17.25 31.4,17.25 | PGEC3.1 32.01,0.85 32.01,1.75 31.89,1.75 31.89,2.9 31.89,5.56 32.03,5.56 v32.03,6.66 30.71,6.66 | v30.71,10.56 30.71,6.66 | 30.71,6.66 30.71,6.5 29.71,6.5 29.71,6.57 28.7,6.57 28.7,5.75 27.54,5.75 27.54,6.17 22.2,6.17 22.2,6.4 v21.63,6.4 21.63,9.24 13.79,9.24 v13.79,6.31 | v32.2,12.1 32.2,16.82 32.05,16.82 32.05,17.25 31.4,17.25
  pour Route15: 16.41,2.07 20.26,2.07 20.26,5.33 12.23,5.33 12.23,9.66 12.27,9.66 12.27,9.79 21.58,9.79 21.58,16.32 -0.36,16.32 -0.36,20.3 35.63,20.3 35.63,-0.35 16.42,-0.35
VM+  (via drill 0.45, 1)
  Top 0.152: v5.27,6.52 5.62,6.52
  Top 0.508: C20.1 v9.11,0.64 v9.1,0.64
  Top 0.6: U1.10 18.28,3.24 C21.1 18.35,2.93 v18.99,2.93 | U2.10 10.46,2.77 v10.42,2.77 10.42,1.71 C23.2
  Top 0.813: 5.62,6.52 CON4.2
  Top 1.016: PWR.3 5.04,5.25 v5.04,5.21 5.04,6.52 v5.27,6.52
  Route15 0.152: v18.99,2.93 18.99,2.92 16.59,2.92 16.59,3.98 13.11,3.98 13.11,2.77 v10.42,2.77 9.1,2.77 | v9.1,0.64 9.1,2.77 | v5.04,5.21 9.1,5.21 9.1,2.77
  pour Route15: 15.86,2.42 19.91,2.42 19.91,4.87 15.26,4.87 11.55,4.87 11.55,8.87 11.55,10.15 21.13,10.15 21.13,15.78 -0.25,15.78 -0.25,-0.29 15.85,-0.29
  pour Bottom: 8.04,2.91 12.48,2.91 12.48,4.29 13.2,4.29 13.2,4.74 14.02,4.74 14.02,5.23 16.22,5.23 16.22,5.29 16.43,5.29 16.43,4.22 16.43,3.99 20.39,3.99 20.82,3.99 20.82,-0.34 8.3,-0.34 8.3,-0.25 8.03,-0.25 8.03,2.9
VSS  (via drill 0.3, 0.6)
  Top 0.15: 26.37,3.01 v26.37,3.06
  Top 0.152: LCP4.6 8.88,18.08 v8.87,18.08 | v16.56,17.94 16.96,17.94 LCP3.6 | LCP2.6 24.8,16.37 v24.8,17.73 | v32.53,17.3 32.53,16.39 LCP1.6 | C17.1 22.22,4.23 v22.22,4.21 | C7.1 22.89,6.67 22.84,6.67 | 22.84,6.67 v22.68,6.67 | C8.1 22.84,6.67 | C16.1 25.38,12.06 25.38,12.4 | 25.38,12.4 v25.38,12.73 | C15.1 25.38,12.4 | C1.1 26.38,12.43 v26.38,12.87 | C2.1 27.83,13.73 v27.85,13.73 | C12.1 28.84,13.02 v28.87,13.02 | C18.1 v30.71,12.82 | C19.1 32.65,9.83 v32.39,9.83 | C4.1 33.91,6.75 v34.49,6.75 34.1,6.75 C3.1 | v34.49,5.59 34.49,5.28 C14.1 | U3.6 27.43,6.58 v27.43,6.64 | U3.33 29.38,8.02 v28.35,8.02 | PWR.1 6.76,2.05 | 26.57,2.92 C13.2 | C6.1 23.46,9.38 C5.1 23.31,9.38 v23.31,9.55 | C13.2 26.4,3.47 26.85,3.47 26.85,3.89 26.92,3.89 U3.12 | 24.45,2.92 LED.C | C13.2 26.4,3.06 v26.37,3.06
  Top 0.2: LCP5.4 3.71,16.81 | 3.71,17.34 LCP5.6 | LCP6.4 3.71,10.95 LCP6.5 3.71,11.64 LCP6.6
  Top 0.203: C13.2 24.45,2.92
  Top 0.6: v7.37,0.71 7.37,2.05 6.76,2.05 | 3.71,10.95 3.71,11.64 | LCP6.5 2.44,11.24 v2.44,11.29 | LCP5.5 3.71,17.34 | LCP5.5 3.71,16.81 | LCP5.5 2.63,17.14 v2.63,17.25
  Route2 0.15: PGEC4.1 29.07,2.88
  Route2 0.152: v16.56,17.94 16.56,17.67 16.56,17.73 | 16.56,17.73 16.56,17.89 15.6,17.89 15.6,17.67 8.87,17.67 v8.87,18.08 7.45,18.08 7.45,18.2 6.09,18.2 6.09,18.08 2.63,18.08 v2.63,17.25 | 16.56,17.73 v24.8,17.73 24.8,17.56 30.92,17.56 30.92,17.75 32.53,17.75 v32.53,17.3 32.53,12.82 v30.71,12.82 | v27.85,13.73 27.85,13.12 | 27.85,13.12 27.85,12.87 v26.38,12.87 25.38,12.87 v25.38,12.73 25.38,12.86 24.5,12.86 24.5,10.27 23.31,10.27 v23.31,9.55 23.31,8.87 22.69,8.87 v22.69,6.67 v22.68,6.67 22.68,4.21 v22.22,4.21 22.22,3.06 v26.37,3.06 | 27.85,13.12 28.87,13.12 v28.87,13.02 30.71,13.02 v30.71,12.82 | v34.49,5.59 v34.49,6.75 33.9,6.75 33.9,7.85 32.51,7.85 32.51,8.1 32.39,8.1 v32.39,9.83 | v27.43,6.64 27.43,8.02 v28.35,8.02 28.35,9.83 v32.39,9.83 | v32.39,9.83 32.39,11.62 31.71,11.62 31.71,11.83 30.72,11.83 v30.72,12.82 v30.71,12.82 | 29.07,2.88 26.85,2.88 26.85,3.06 v26.37,3.06 | 26.37,2.88 v26.37,3.06
  Bottom 0.6: v7.37,0.71 1.4,0.71 1.4,11.29 | 1.4,11.29 v2.44,11.29 | v2.63,17.25 1.4,17.25 1.4,11.29
  pour Route2: 15.35,4.43 20.89,4.43 20.96,4.43 20.96,10.31 20.96,10.35 23.16,10.35 23.32,10.35 23.32,14.54 -0.28,14.54 -0.28,20.19 35.34,20.19 35.34,-0.67 15.35,-0.67
(copper drawn outside any net)
  shapes: Top area x2

### Text on the board
tNames: M0 | UART1 | M1 | M2 | M3 | TX | UART2 | 1 | RX | VM+ | 1 | 1 | 40 | 16 | 16 | vss | !MCLR! | PD | VD | VS | RC3 | RC8 | PC